# EAGLE design arduinoRGBkaleidoscopeCkt2_v3 (EAGLE 9.2.2)
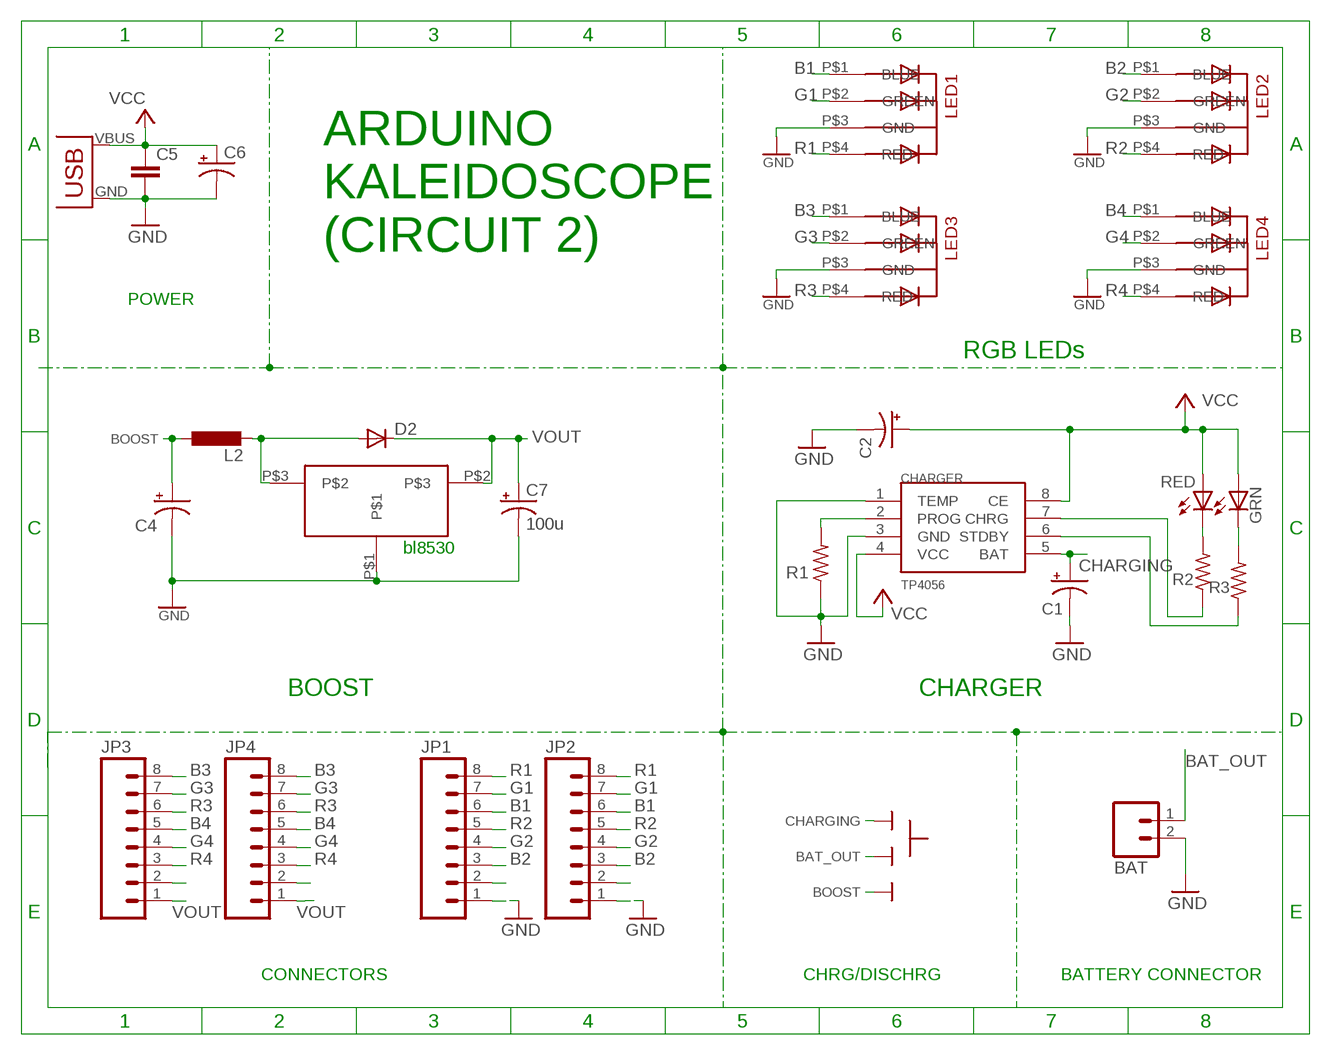
[diagram p0: schematic, sheet 1]

## Parts
BAT  M02  [02P]
BOOST  BL8530_5V  [BL8530_5V]
C1  10u  CAP_POL_10V  [C/6032-28R]
C2  10u  CAP_POL_10V  [C/6032-28R]
C4  10u  CAP_POL_10V  [C/6032-28R]
C5  C-EU025-024X044  [C025-024X044]
C6  CPOL-USE2,5-6E  [E2,5-6E]
C7  100u  CAP_POL_10V  [C/6032-28R]
CHARGER  TP4056  [SOP-8]
CHRG/DISCHRG  SLIDESWITCH-BIG  [BIGSWITCH]
D2  DIODE-DO214AA  [DO214AA]
GRN  LED3MM  LEDCHIPLED_0805  [CHIPLED_0805]
JP1  M081X08  [1X08]
JP2  M081X08  [1X08]
JP3  M081X08  [1X08]
JP4  M081X08  [1X08]
L2  47uH  L-EUL4532P  [L4532P]
LED1  5MMRGBLED  [LED5MMRGB]
LED2  5MMRGBLED  [LED5MMRGB]
LED3  5MMRGBLED  [LED5MMRGB]
LED4  5MMRGBLED  [LED5MMRGB]
R1  RESISTOR0805  [R0805]
R2  470  RESISTOR0805  [R0805]
R3  470  RESISTOR0805  [R0805]
RED  LED3MM  LEDCHIPLED_0805  [CHIPLED_0805]
U$1  USB(POWER)  [USB(POWER)]

## Nets
B1: JP1.6 JP2.6 LED1.P$1(BLUE)
B2: JP1.3 JP2.3 LED2.P$1(BLUE)
B3: JP3.8 JP4.8 LED3.P$1(BLUE)
B4: JP3.5 JP4.5 LED4.P$1(BLUE)
BAT_OUT [Power]: BAT.1 CHRG/DISCHRG.2
BOOST: C4.+ CHRG/DISCHRG.3 L2.1
CHARGING: C1.+ CHARGER.5(BAT) CHRG/DISCHRG.1
G1: JP1.7 JP2.7 LED1.P$2(GREEN)
G2: JP1.4 JP2.4 LED2.P$2(GREEN)
G3: JP3.7 JP4.7 LED3.P$2(GREEN)
G4: JP3.4 JP4.4 LED4.P$2(GREEN)
GND [Power]: BAT.2 BOOST.P$1 C1.- C2.- C4.- C5.2 C6.- C7.- CHARGER.1(TEMP) CHARGER.3(GND) JP1.1 JP2.1 LED1.P$3(GND) LED2.P$3(GND) LED3.P$3(GND) LED4.P$3(GND) R1.1 U$1.GND
N$1: CHARGER.2(PROG) R1.2
N$4: R2.2 RED.C
N$5: CHARGER.7(CHRG) R2.1
N$6: CHARGER.6(STDBY) R3.1
N$8: BOOST.P$3 D2.A L2.2
N$13: JP1.2
N$15: GRN.C R3.2
N$22: JP2.2
N$30: JP3.2
N$33: JP4.2
R1: JP1.8 JP2.8 LED1.P$4(RED)
R2: JP1.5 JP2.5 LED2.P$4(RED)
R3: JP3.6 JP4.6 LED3.P$4(RED)
R4: JP3.3 JP4.3 LED4.P$4(RED)
VCC [Power]: C2.+ C5.1 C6.+ CHARGER.4(VCC) CHARGER.8(CE) GRN.A RED.A U$1.VBUS(VCC)
VOUT [Power]: BOOST.P$2 C7.+ D2.C JP3.1 JP4.1

## Notes on the sheet
- ARDUINO
  KALEIDOSCOPE
  (CIRCUIT 2)
- POWER
- RGB LEDs
- bl8530
- BOOST | CHARGER
- CONNECTORS | BATTERY CONNECTOR

## Library data of the parts
BAT = CEDT_JANUARY_2015_v5:M02: AMP QUICK CONNECTOR
BOOST = PSU_TT_SMD:BL8530_5V
C1 C4 = CEDT_JANUARY_2015_v5:CAP_POL
C2 C7 = CEDT_JANUARY_2015_v7:CAP_POL
C5 = rcl:C-EU: CAPACITOR, European symbol; SPICEPREFIX: C
C6 = rcl:CPOL-US: POLARIZED CAPACITOR, American symbol; SPICEPREFIX: C
CHARGER = TP4056:TP4056
CHRG/DISCHRG = CEDT_JANUARY_2015_v5:SLIDESWITCH
D2 = diode:DIODE-: DIODE
GRN RED = 01_adafruit:LED: LED OSRAM: - CHIPLED LG R971, LG N971, LY N971, LG Q971, LY Q971, LO R971, LY R971 LH N974, LH R974 LS Q976, LO Q976, LY Q976 LO Q996 - Hyper CHIPLED LW Q18S LB Q993, LB Q99A, LB R99A - SideLED LS A670, LO A670, LY A670, LG A670, LP A670 LB A673, LV A673, LT A673, LW A673 LH A674 LY A675 LS A676, LA A676, LO A676, LY A676, LW A676 LS A679, LY A679, LG A679 - Hyper Micro SIDELED® LS Y876, LA Y876, LO Y876, LY Y876 LT Y87S - SmartLED LW L88C, LW L88S LB L89C, LB L89S, LG L890 LS L89K, LO L89K, LY L89K LS L896, LA L896, LO L896, LY L896 - TOPLED LS T670, LO T670, LY T670, LG T670, LP T670 LSG T670, LSP T670, LSY T670, LOP T670, LYG T670 LG T671, LOG T671, LSG T671 LB T673, LV T673, LT T673, LW T673 LH T674 LS T676, LA T676, LO T676, LY T676, LB T676, LH T676, LSB T676, LW T676 LB T67C, LV T67C, LT T67C, LS T67K, LO T67K, LY T67K, LW E67C LS E67B, LA E67B, LO E67B, LY E67B, LB E67C, LV E67C, LT E67C LW T67C LS T679, LY T679, LG T679 LS T770, LO T770, LY T770, LG T770, LP T770 LB T773, LV T773, LT T773, LW T773 LH T774 LS E675, LA E675, LY E675, LS T675 LS T776, LA T776, LO T776, LY T776, LB T776 LHGB T686 LT T68C, LB T68C - Hyper Mini TOPLED® LB M676 - Mini TOPLED Santana® LG M470 LS M47K, LO M47K, LY M47K Source: http://www.osram.convergy.de/
JP1-JP4 = SparkFun-Connectors:M08: Header 8 Standard 8-pin 0.1" header. Use with straight break away headers (SKU : PRT-00116), right angle break away headers (PRT-00553), swiss pins (PRT-00743), machine pins (PRT-00117), and female headers (PRT-00115).
L2 = rcl:L-EU: INDUCTOR, European symbol
LED1-LED4 = led_rgb:5MMRGBLED
R1-R3 = CEDT_JANUARY_2015_v5:RESISTOR
U$1 = CEDT_JANUARY_2015_v7:USB(POWER)

## Net classes
1 Power: width 0.508 mm

## Board
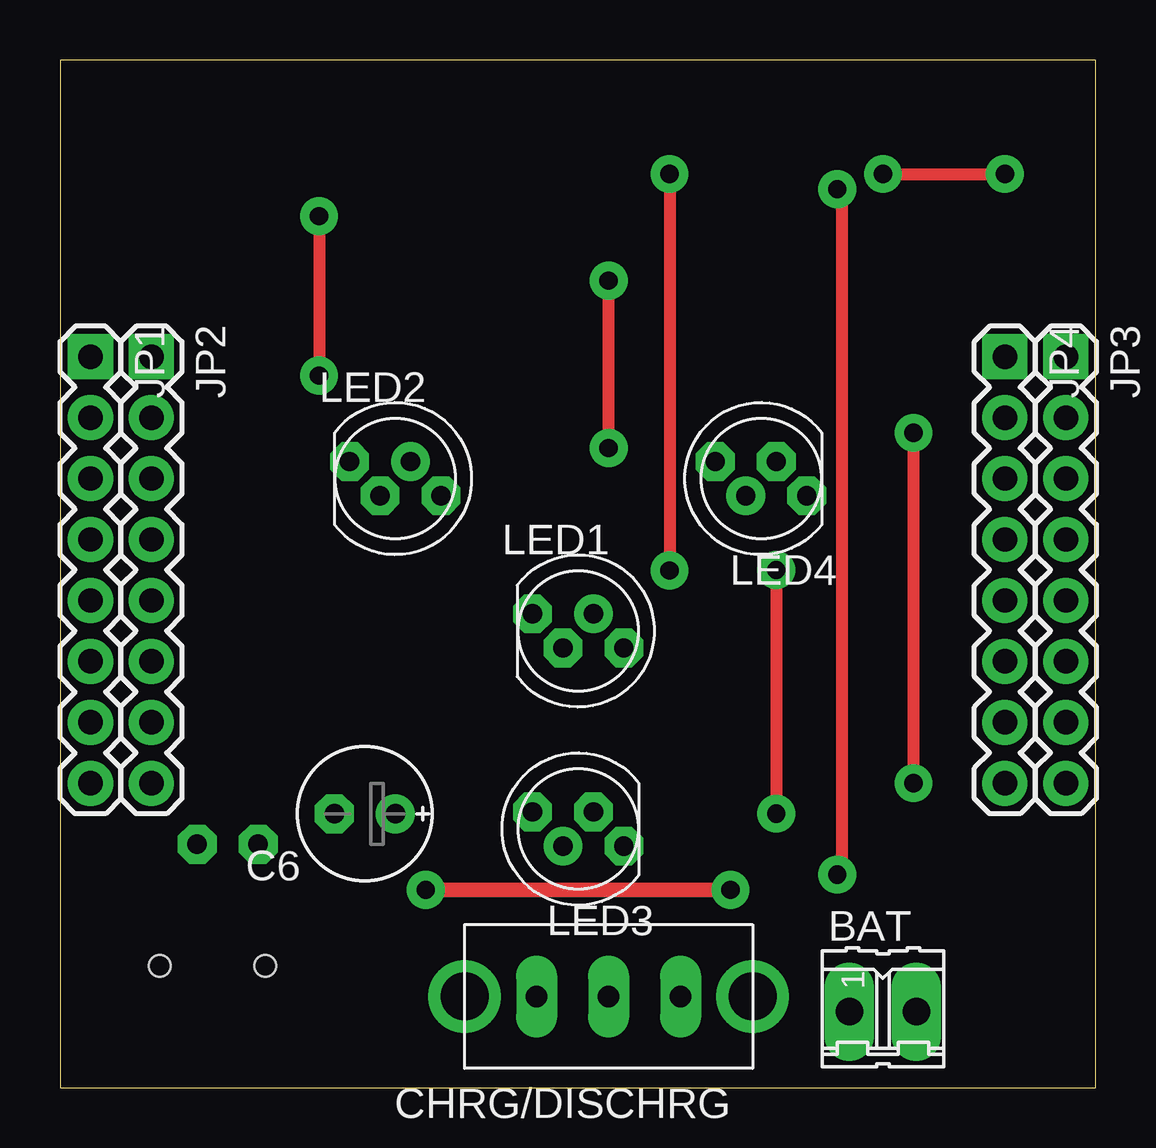
[diagram p1: board, top side]
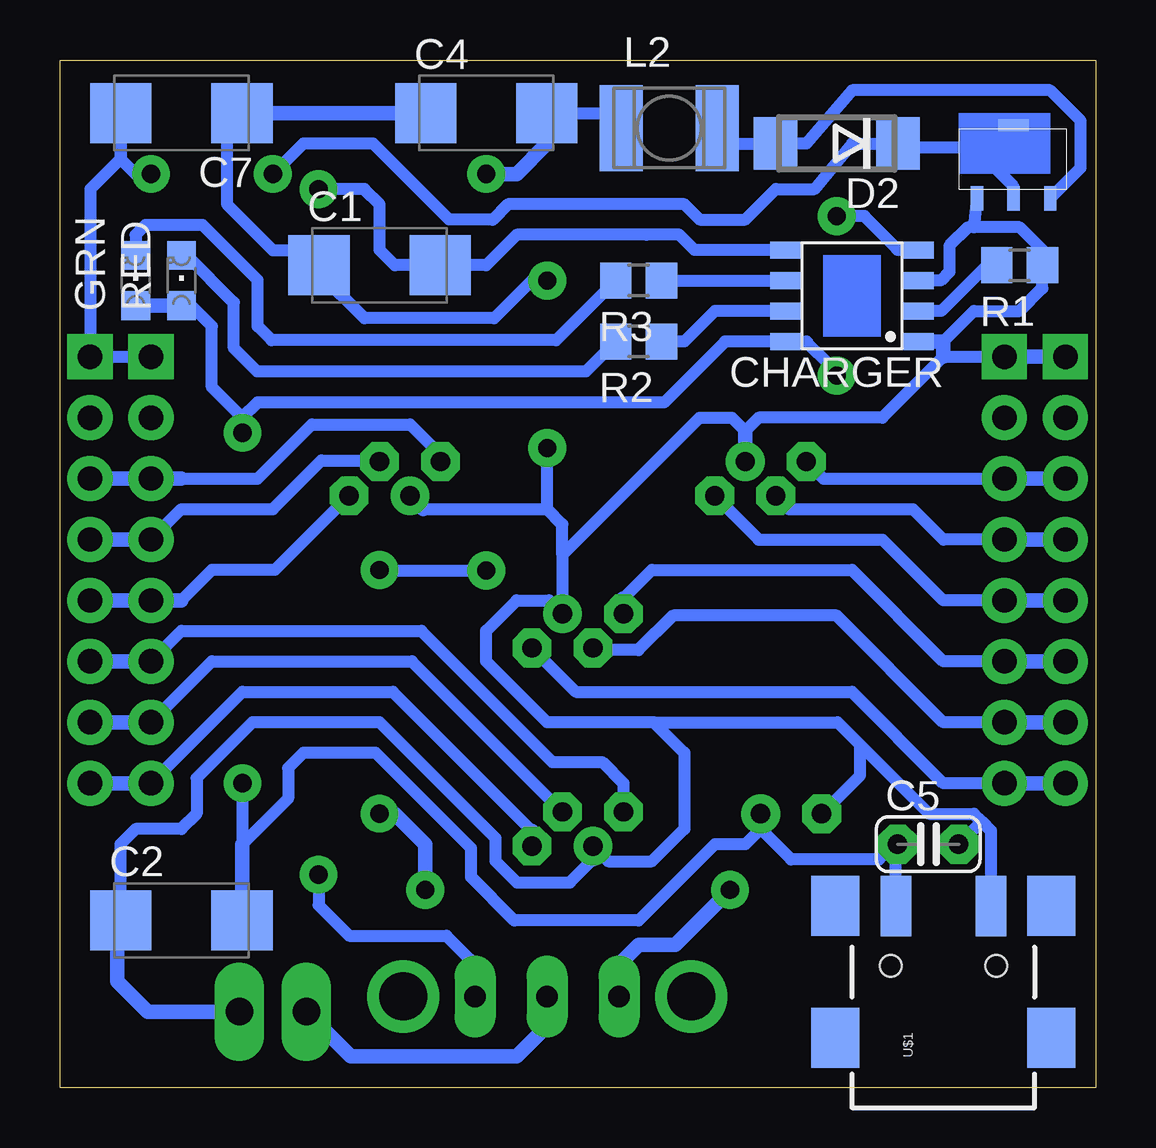
[diagram p2: board, bottom side, seen from below]

Size 43.16 x 42.85 mm. Coordinates in mm from the lower left corner, seen from the top.
Outline: 0,0 43.16,0 43.16,42.85 0,42.85 0,0
Copper layers (1*16): Top 0.035mm / dielectric 1.5mm / Bottom 0.035mm
Design rules "default *": minimum track width 6mil, minimum drill 0.35mm, track to track 16mil, track to pad 16mil, pad to pad 16mil, via to via 16mil, smd to smd 16mil, copper to edge 40mil, drill to drill 8mil, minimum pad ring 16mil, minimum via ring 16mil, stop-mask expansion 4mil, vias tented up to drill 0mil, thermal gap 10mil

### Footprints (pad centres in the part's own frame; a part is rotated, then mirrored left to right if it is on the bottom)
02P = drill 1.143 long: 1 -1.397,0; 2 1.397,0
BL8530_5V = smd 0.508 x 1.016: P$1 0.762,-0.381; P$2 2.286,-0.381; P$3 3.81,-0.381 | smd 1.27 x 0.508: P$4 2.286,2.667
C/6032-28R = smd 2.55 x 2.5: + 2.525,0; - -2.525,0
C025-024X044 = drill 0.813 octagon: 1 -1.27,0; 2 1.27,0
E2,5-6E = drill 0.813 pad 1.575: + -1.27,0 | drill 0.813 pad 1.575 octagon: - 1.27,0
SOP-8 = smd 1.3 x 0.7: 1 -2.75,1.905; 2 -2.75,0.635; 3 -2.75,-0.635; 4 -2.75,-1.905; 5 2.75,-1.905; 6 2.75,-0.635; 7 2.75,0.635; 8 2.75,1.905
BIGSWITCH = drill 0.9 long: 1 -3,0; 2 0,0; 3 3,0 | drill 2 pad 2.184: TAB1 -6,0; TAB2 6,0
DO214AA = smd 1.8 x 2.2: A 2.55,0; C -2.55,0
CHIPLED_0805 = smd 1.2 x 1.2: A 0,-1.05; C 0,1.05
1X08 = drill 1.016 pad 1.88 square: 1 0,0 | drill 1.016 pad 1.88: 2 2.54,0; 3 5.08,0; 4 7.62,0; 5 10.16,0; 6 12.7,0; 7 15.24,0; 8 17.78,0
L4532P = smd 1.8 x 3.6: 1 -2,0; 2 2,0
LED5MMRGB = drill 0.8 pad 0.813 octagon: P$1 -1.905,0.714; P$2 -0.635,-0.714; P$4 1.905,-0.714 | drill 0.8 pad 0.813: P$3 0.635,0.714
R0805 = smd 1.3 x 1.5: 1 -0.95,0; 2 0.95,0
USB(POWER) = smd 2.54 x 1.27: GND 2.5,-1.981; VBUS 2.5,1.981 | smd 2.5 x 2: GND@1 -3,-4.5; GND@2 -3,4.5; GND@3 2.5,4.5; GND@4 2.5,-4.5 | hole 0.9: 0,2.2; 0,-2.2

### Placement (x,y rotation side)
BAT  34.29,3.17 0 top
BOOST  5.71,37.47 0 bottom
C1  29.84,34.29 0 bottom
C2  38.1,6.99 0 bottom
C4  25.4,40.64 0 bottom
C5  6.99,10.16 0 bottom
C6  12.7,11.43 180 top
C7  38.1,40.64 180 bottom
CHARGER  10.16,33.02 180 bottom
CHRG/DISCHRG  22.86,3.81 180 top
D2  10.79,39.37 180 bottom
GRN  40.01,33.66 0 bottom
JP1  1.27,30.48 270 top
JP2  3.81,30.48 270 top
JP3  41.91,30.48 270 top
JP4  39.37,30.48 270 top
L2  17.78,40.01 0 bottom
LED1  21.59,19.05 0 top
LED2  13.97,25.4 0 top
LED3  21.59,10.79 180 top
LED4  29.21,25.4 180 top
R1  3.17,34.29 180 bottom
R2  19.05,31.11 180 bottom
R3  19.05,33.66 180 bottom
RED  38.1,33.66 0 bottom
U$1  6.35,5.08 90 bottom

### Tracks (layer width: path | path; a pad name or v marks a point on that pad's centre or on a via)
B1
  Bottom 0.508: JP2.6 6.35,17.78 10.16,21.59 18.49,21.59 19.68,20.4
  Bottom 0.61: JP1.6 JP2.6 | LED1.P$1 19.68,20.4
B2
  Bottom 0.508: LED2.P$1 11.35,25.4 JP2.3
  Bottom 0.61: JP1.3 JP2.3
B3
  Bottom 0.508: 23.5,10.72 29.29,16.51 35.56,16.51 JP4.8
  Bottom 0.61: LED3.P$1 23.5,10.72 | JP3.8 JP4.8
B4
  Bottom 0.508: LED4.P$1 34.21,21.59 36.83,21.59 38.1,20.32
  Bottom 0.61: 38.1,20.32 JP4.5 JP3.5
BAT_OUT
  Bottom 0.61: BAT.1 31.04,1.32 24.13,1.32 22.86,2.59 CHRG/DISCHRG.2
BOOST  (via drill 0.76 pad 1.27)
  Top 0.508: v29.84,21.59 v29.84,11.43 | v25.4,38.1 v25.4,21.57
  Top 0.61: v27.94,8.26 v15.24,8.26
  Bottom 0.508: C4.+ 20.41,40.64 L2.1 | 29.82,21.57 v25.4,21.57
  Bottom 0.61: C4.+ 22.88,39.35 24.13,38.1 v25.4,38.1 | v29.84,21.59 29.82,21.57 | 19.86,4.27 CHRG/DISCHRG.3 19.86,5.16 19.05,5.97 17.53,5.97 v15.24,8.26 | v29.84,11.43 29.21,11.43 27.94,10.16 v27.94,8.26
CHARGING  (via drill 0.76 pad 1.27)
  Top 0.508: v32.38,37.47 32.58,37.47 32.58,8.89 v32.38,8.89
  Bottom 0.508: CHARGER.5 16.72,34.92 17.38,35.59 18.69,35.59 18.71,35.56 24.13,35.56 25.4,34.29 C1.+ 29.21,34.29 29.84,34.92 29.84,36.83 30.48,37.47 v32.38,37.47 | CHRG/DISCHRG.1 26.06,4.01 26.06,5.34 27.06,6.35 31.11,6.35 32.38,7.62 v32.38,8.89
G1
  Bottom 0.508: JP2.7 6.35,15.24 10.79,19.68 17.62,19.68 19.06,18.25 20.31,18.25
  Bottom 0.61: JP1.7 JP2.7 | 20.31,18.25 20.4,18.34 LED1.P$2
G2
  Bottom 0.508: JP2.4 6.35,22.86 7.62,24.13 12.78,24.13 LED2.P$2
  Bottom 0.61: JP1.4 JP2.4
G3
  Bottom 0.508: JP4.7 36.83,17.78 28.5,17.78 LED3.P$2
  Bottom 0.61: JP3.7 JP4.7
G4
  Bottom 0.508: JP4.4 38.1,24.13 34.29,24.13 32.27,26.15 30.51,26.15 30.47,26.11 LED4.P$2
  Bottom 0.61: JP3.4 JP4.4
GND  (via drill 0.76 pad 1.27)
  Top 0.508: v22.86,26.67 v22.86,33.66
  Bottom 0.508: 22.23,22.23 LED1.P$3 22.78,20.32 24.13,20.32 25.4,19.05 25.4,17.78 22.86,15.24 18.41,15.24 | 18.41,15.24 17.14,13.97 17.14,10.79 18.49,9.45 20.32,9.45 LED3.P$3 | C2.- 40.62,10.14 40.64,10.16 40.01,10.79 38.1,10.79 37.47,11.43 37.47,12.91 35.14,15.24 29.84,15.24 25.01,10.41 25.01,9.45 24.12,8.56 21.92,8.56 20.95,9.53 | 18.41,15.24 10.76,15.24 9.82,14.31 | 6.35,31.11 5.08,32.38 3.17,32.38 2.23,33.34 R1.1 2.03,34.48 2.03,34.74 3.17,35.88 5.08,35.88 | 22.23,22.23 22.23,23.5 22.86,24.13 | 22.23,22.23 16.51,27.94 15.16,27.94 14.61,27.38 14.05,27.94 8.89,27.94 6.35,30.48 JP2.1 | CHARGER.3 6.47,33.66 6.1,34.02 6.1,35.1 5.32,35.88 5.08,35.88 | 9.82,14.31 6.95,11.43 5.08,11.43 4.76,11.11 | 4.76,11.11 4.37,10.72 U$1.GND | 22.86,24.13 v22.86,26.67 | 28.02,24.13 22.86,24.13 | v22.86,33.66 23.5,33.66 25.07,32.08 30.48,32.08 32.37,33.97 C1.- | 34.92,39.99 C7.- 36.21,40.01 36.21,36.84 34.27,34.91 32.37,34.91 C1.- | 33.16,34.29 C1.- | JP1.1 1.32,30.48 | C6.- 9.82,13.04 9.82,14.31 | 4.76,11.11 C5.2 | BOOST.P$1 5.08,35.88
  Bottom 0.61: C2.- 40.77,6.84 40.77,4.45 39.5,3.17 BAT.2 | 14.61,27.38 LED2.P$3 | 20.95,9.65 LED3.P$3 20.95,9.53 | CHARGER.1 6.35,31.11 6.35,30.48 | 1.32,30.48 JP2.1 | LED4.P$3 28.02,24.13 | C4.- C7.-
N$1
  Bottom 0.508: 4.12,34.38 R1.2 | 4.45,34.38 6.45,32.38 6.99,32.38
  Bottom 0.61: 4.12,34.38 4.45,34.38 | 6.99,32.38 CHARGER.2
N$4
  Bottom 0.508: R2.2 21.25,29.87 34.95,29.87 35.92,30.84 35.92,32.74 37.88,34.7 RED.C
N$5
  Bottom 0.508: CHARGER.7 15.88,32.38 17.14,31.11 R2.1
N$6
  Bottom 0.508: R3.1 CHARGER.6
N$8
  Bottom 0.508: L2.2 15.14,39.37 D2.A 12.06,39.37 10.16,41.58 1.91,41.58 0.64,40.31 0.64,38.35 BOOST.P$3
N$15
  Bottom 0.508: R3.2 22.49,31.17 34.34,31.17 34.92,31.75 34.92,33.68 37.21,35.97 39.6,35.97 40.01,35.56 GRN.C | GRN.C 40.01,34.84 | 40.01,34.92 GRN.C
R1
  Bottom 0.508: JP2.8 6.35,12.7 10.16,16.51 21.67,16.51 LED1.P$4
  Bottom 0.61: JP1.8 JP2.8
R2
  Bottom 0.508: JP2.5 6.35,20.32 8.89,22.86 14.05,22.86 LED2.P$4
  Bottom 0.61: JP1.5 JP2.5
R3
  Bottom 0.508: LED3.P$4 19.68,12.7 20.57,13.59 22.65,13.59 28.11,19.05 38.1,19.05 JP4.6
  Bottom 0.61: JP3.6 JP4.6
R4
  Bottom 0.508: 38.1,25.4 34.92,25.4 32.66,27.66 28.57,27.66 27.3,26.39 LED4.P$4 | JP3.3 41.84,25.4
  Bottom 0.61: 38.1,25.4 JP4.3 41.84,25.4
VCC  (via drill 0.76 pad 1.27)
  Top 0.508: v35.56,27.3 v35.56,12.7 | v10.79,36.34 v10.79,29.7
  Bottom 0.508: v35.56,12.7 35.56,10.16 33.66,12.06 33.66,13.34 33.02,13.97 30.01,13.97 26.03,9.99 26.03,8.79 24.23,6.99 19.05,6.99 15.88,10.16 14.61,10.16 13.97,10.79 | 35.56,8.26 35.56,7 C2.+ | v10.79,29.7 10.79,29.84 11.61,30.66 11.63,30.66 12.02,31.05 12.02,31.07 12.06,31.11 CHARGER.8 15.45,31.11 17.99,28.57 34.92,28.57 35.56,27.94 36.83,29.21 36.83,31.75 37.69,32.6 RED.A | CHARGER.4 8.26,34.92 8.3,34.97 8.3,34.99 9.65,36.34 v10.79,36.34 | U$1.VBUS 8.33,10.24 | C6.+ 13.97,10.79 | 8.33,10.24 C5.1 | 8.33,10.24 9.04,9.53 12.7,9.53 13.97,10.79
  Bottom 0.61: 35.56,27.94 v35.56,27.3 | C2.+ 35.58,9.46 35.56,9.48 35.56,10.16 | GRN.A RED.A
VOUT  (via drill 0.76)
  Top 0.508: v34.29,38.1 v39.37,38.1
  Bottom 0.508: C7.+ 40.62,38.73 41.89,37.47 41.89,30.48 | 41.89,30.48 JP4.1 | 40.62,40.04 C7.+ | v34.29,38.1 33.02,39.37 30.11,39.37 26.94,36.2 25.15,36.2 25.14,36.19 24.5,36.83 17.14,36.83 16.51,36.2 14.61,36.2 13.34,37.47 11.72,37.47 10.16,39.37 D2.C 8.09,39.22 5.08,39.22 3.43,37.57 BOOST.P$2 | v39.37,38.1 40.01,38.1 40.62,38.72 C7.+ | JP3.1 41.89,30.48
(copper drawn outside any net)
  shapes: Bottom area x1